# Altium schematic sheet INA236_Sensor.SchDoc: =SheetTitle
size A4; SheetTitle: Power Measurement; DrawnBy: Samyar Sadat Akhavi
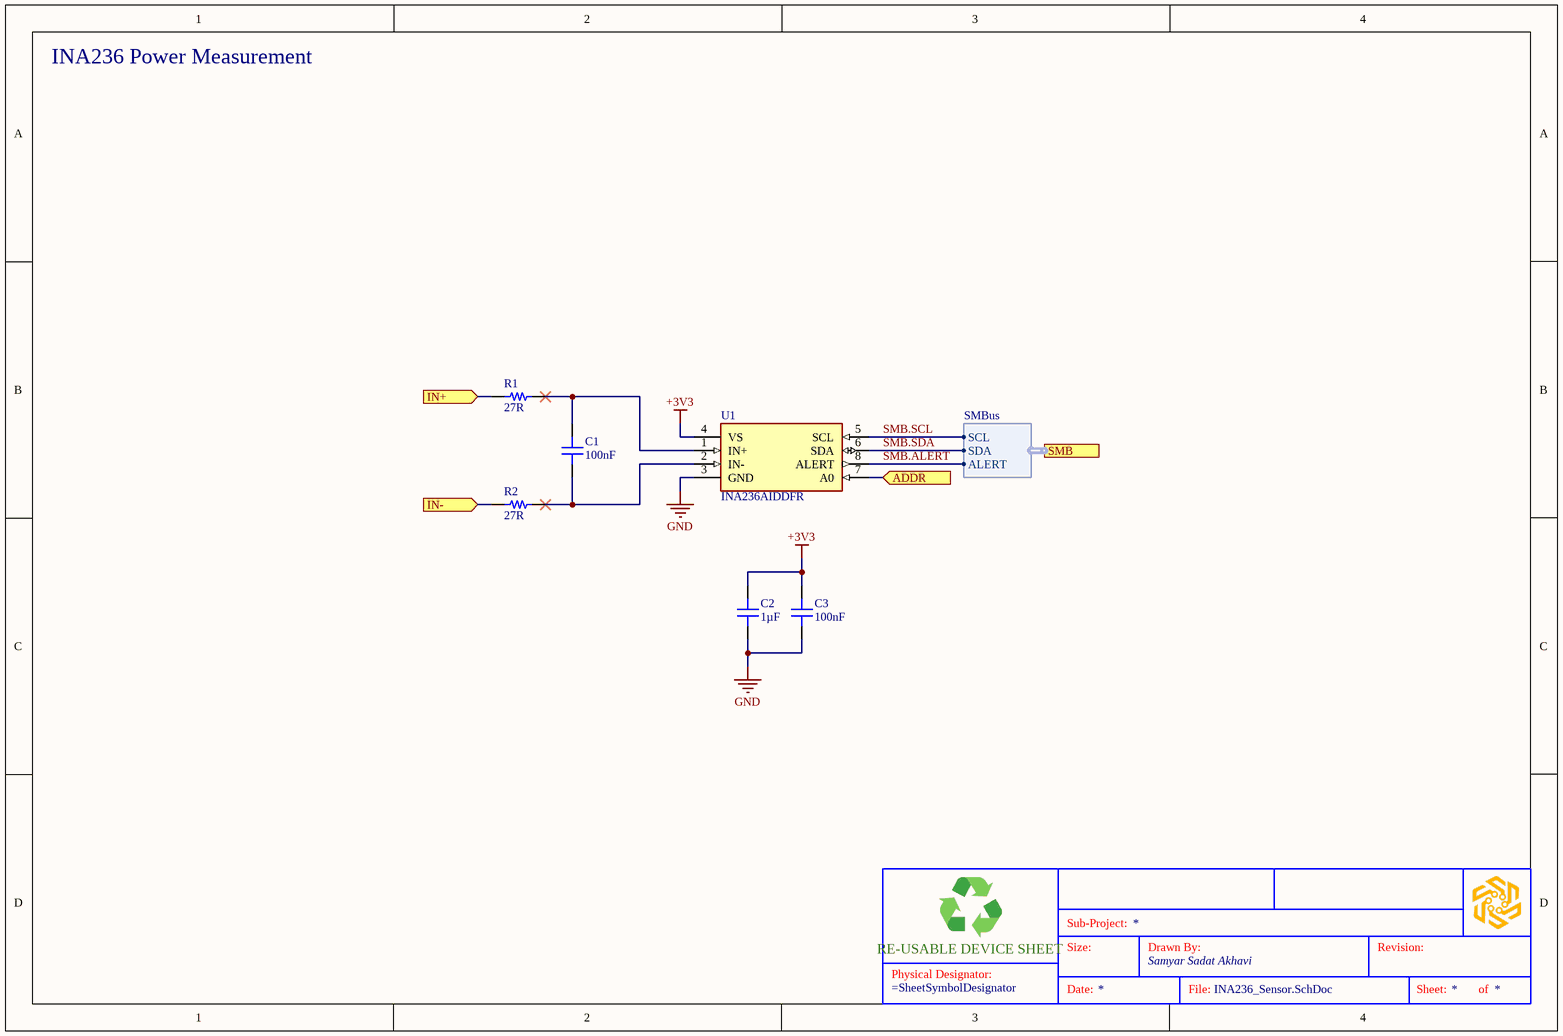
[diagram p0: INA236_Sensor.SchDoc]

## Parts
(Parts that share a designator on the sheet are numbered #1, #2 ... from top to bottom, then left to right.)
?  (no value)  (graphical)
C1  100nF  [CAP 0603_1608]
C2  1µF  [CAP 0603_1608]
C3  100nF  [CAP 0603_1608]
GRAPH?#1  SGR-STDDSM  (value not drawn)  (graphical)
GRAPH?#2  SGR-STDSDES  (value not drawn)  (graphical)
R1  27R  [RES 0603_1608]
R2  27R  [RES 0603_1608]
U1  INA236AIDDFR  [SOT23-8_DDF_TEX]

## Ports
ADDR (in, see Voltage_Regulators[4D], TMP112_Sensor[2B]), IN+ (in, see Voltage_Regulators[3D]), IN- (in, see Voltage_Regulators[3D]), SMB (harness SMBus, see Voltage_Regulators[4D], Battery_Input[4A], Charger_Input[1C], TMP112_Sensor[3B], VBAT_Output[3B])

## Harnesses
SMBus: SDA, SCL, ALERT

## Nets
+3V3: C2.2 C3.1 U1.4(VS)
GND: C2.1 C3.2 U1.3(GND)
ADDR: U1.7(A0) ; port ADDR
IN+: R1.1 ; port IN+
IN-: R2.1 ; port IN-
SMB.ALERT: U1.8(ALERT) ; port SMB.ALERT
SMB.SCL: U1.5(SCL) ; port SMB.SCL
SMB.SDA: U1.6(SDA) ; port SMB.SDA
NetC1_1: C1.1 R1.2 U1.1(IN+)
NetC1_2: C1.2 R2.2 U1.2(IN-)

## Notes on the sheet
- INA236 Power Measurement
- Sub-Project:
- Size:
- Drawn By:
- Revision:
- Date:
- File:
- Sheet:
- of
- (in symbol SGR-STDDSM) RE-USABLE DEVICE SHEET
- (in symbol SGR-STDSDES) Physical Designator:

## Library data of the parts
? = SGR-STDTBSA4: STANDARD SCHEMATICS TITLE BLOCK
C1 C3 = GEN-CC100NT10V50KX7R603: GENERIC 0603 MLC CAPACITOR; Tolerance: ±10%; Voltage: 50V; Dielectric: X7R; Part Number: GEN-CC100NT10V50KX7R603; Value: 100nF
C2 = GEN-CC1UT10V25KX7R603: GENERIC 0603 MLC CAPACITOR; Tolerance: ±10%; Voltage: 25V; Dielectric: X7R; Part Number: GEN-CC1UT10V25KX7R603; Value: 1µF
GRAPH?#1 = SGR-STDDSM: STANDARD DEVICE SHEET MARKING; Part Number: SGR-STDDSM
GRAPH?#2 = SGR-STDSDES: STANDARD SHEET SYMBOL DESIGNATOR MARKING; Part Number: SGR-STDSDES
R1 R2 = GEN-CRR27T1P8603: GENERIC 0603 CHIP RESISTOR; Tolerance: ±1%; Power: 0.125W; Part Number: GEN-CRR27T1P8603; Value: 27R
U1 = INA236AIDDFR: IC CURRENT MON 0.015% TSOT23-8; Manufacturer: Texas Instruments; Copyright: Copyright (C) 2025 Ultra Librarian. All rights reserved.; Part Number: INA236AIDDFR; Supplier 1: DigiKey; Supplier Part Number 1: 296-INA236AIDDFRCT-ND